# Altium schematic sheet Power Supply.SchDoc: Power Supply
size A4; Engineer: M.GUENI; Organization: Altium Limited; Address1: L3, 12a Rodborough Rd; Address2: Frenchs Forest; Address3: NSW; Address4: Australia 2086; Revision: R0; SheetNumber: 2; SheetTotal: 8
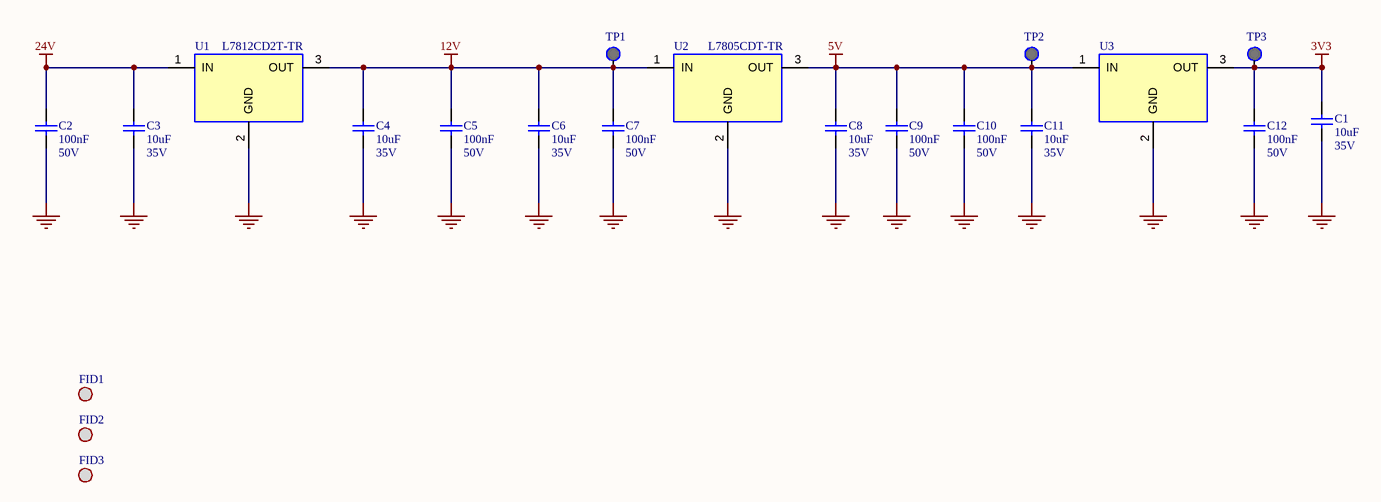
[diagram p0: Power Supply.SchDoc]

## Parts
C1  Value 1: 10uF  Value 2: 35V  [CAPC1608N]  (hidden comment: Capacitor)
C2  Value 1: 100nF  Value 2: 50V  [CAPC1608N]  (hidden comment: Capacitor)
C3  Value 1: 10uF  Value 2: 35V  [CAPC1608N]  (hidden comment: Capacitor)
C4  Value 1: 10uF  Value 2: 35V  [CAPC1608N]  (hidden comment: Capacitor)
C5  Value 1: 100nF  Value 2: 50V  [CAPC1608N]  (hidden comment: Capacitor)
C6  Value 1: 10uF  Value 2: 35V  [CAPC1608N]  (hidden comment: Capacitor)
C7  Value 1: 100nF  Value 2: 50V  [CAPC1608N]  (hidden comment: Capacitor)
C8  Value 1: 10uF  Value 2: 35V  [CAPC1608N]  (hidden comment: Capacitor)
C9  Value 1: 100nF  Value 2: 50V  [CAPC1608N]  (hidden comment: Capacitor)
C10  Value 1: 100nF  Value 2: 50V  [CAPC1608N]  (hidden comment: Capacitor)
C11  Value 1: 10uF  Value 2: 35V  [CAPC1608N]  (hidden comment: Capacitor)
C12  Value 1: 100nF  Value 2: 50V  [CAPC1608N]  (hidden comment: Capacitor)
FID1  Fiducial  [FIDUCIAL-1MM]  (value not drawn)
FID2  Fiducial  [FIDUCIAL-1MM]  (value not drawn)
FID3  Fiducial  [FIDUCIAL-1MM]  (value not drawn)
TP1  Test Point  [TP]  (value not drawn)  (no BOM)
TP2  Test Point  [TP]  (value not drawn)  (no BOM)
TP3  Test Point  [TP]  (value not drawn)  (no BOM)
U1  L7812CD2T-TR  [D2PAK]
U2  L7805CDT-TR  [D2PAK]
U3  (no value)  [DPAK]

## Nets
3V3: C1.2 C12.1 TP3.1 U3.3(OUT)
5V: C8.2 C9.1 C10.1 C11.2 TP2.1 U2.3(OUT) U3.1(IN)
12V: C4.2 C5.1 C6.2 C7.1 TP1.1 U1.3(OUT) U2.1(IN)
24V: C2.1 C3.2 U1.1(IN)
GND: C1.1 C2.2 C3.1 C4.1 C5.2 C6.1 C7.2 C8.1 C9.2 C10.2 C11.1 C12.2 U1.2(GND) U2.2(GND) U3.2(GND)

## Notes on the sheet
- THIS DOCUMENT AND THE DATA DISCLOSED HEREIN OR
- HEREWITH IS THE PROPERTY OF ALTIUM LIMITED AND MAY
- DWG NO:
- REVISION
- REV:
- DESCRIPTION
- DATE
- APPROVED
- BE FREELY DISTRIBUTED IN WHOLE. NO RIGHTS ARE
- RESERVED OR EXPRESS OR IMPLIED WARANTEE GIVEN.
- ENG:
- APPROVALS
- PROJECT
- DSN:
- CHK:
- REFERENCE DOCUMENTS
- PROJECT REVISION:
- TITLE
- DOCUMENT REVISION:
- DESIGN ITEM:
- BOM:
- FAB DWG:
- PCB DWG:
- ASSY DWG:
- SCALE:
- A3
- SIZE
- CAGE CODE
- FILE NAME
- DWG NO.
- SHEET
- OF
- REV

## Library data of the parts
C1 C3 C4 C6 C8 C11 = CAP-000000006: MAN: Murata Electronics; MANREF: GRM188R6YA106MA73D; DES: Multilayer Ceramic Capacitors MLCC - SMD/SMT 0603 10uF 35volts *Derate Voltage/Temp; TOL: 20%; FTP: 0603; SUP: Mouser; SUPREF: 81-GRM188R6YA106MA3D; NOTE: _; Part Number: CAP-000000006
C2 C5 C7 C9 C10 C12 = CAP-000000002: MAN: VISHAY; MANREF: VJ0603V104ZXAPW1BC; DES: VJ0603V104ZXAPW1BC -  Condensateur céramique multicouche CMS, 0.1 µF, 50 V, 0603 [1608 Metric], +80%, -20%, Y5V; TOL: +80% -20%; FTP: 0603; SUP: Farnell; SUPREF: 2896408; NOTE: _; Part Number: CAP-000000002
FID1-FID3 = MIS-000000004: MAN: _; Value 1: 1mm; Part Number: MIS-000000004; MANREF: _; DES: _; Value 2: _; TOL: _; FTP: _; SUP: _; SUPREF: _; NOTE: _
TP1-TP3 = MIS-000000003: MAN: _; Part Number: MIS-000000003; MANREF: _; DES: _; Value 1: _; Value 2: _; TOL: _; FTP: _; SUP: _; SUPREF: _; NOTE: _
U1 = VRG-000000002: MAN: STMicroelectronics; DES: Linear Voltage Regulators 12V 1.5A Positive; Value 1: 12V; Value 2: 1.5A; TOL: _; SUP: Mouser; SUPREF: 511-L7812CD2T-TR; Part Number: VRG-000000002; MANREF: L7812CD2T-TR; FTP: D2PAK; NOTE: _
U2 = VRG-000000001: MAN: STMicroelectronics; DES: Linear Voltage Regulators 5.0V 1.5A Positive; Value 1: 5V; Value 2: 1.5A; TOL: _; SUP: Mouser; SUPREF: 511-L7805CDT-TR; Part Number: VRG-000000001; MANREF: L7805CDT-TR; FTP: D2PAK; NOTE: _
U3 = VRG-000000003: MAN: STMicroelectronics; MANREF: LF33CDT-TRY; DES: Linear Voltage Regulators VLDV Reg Inhibit 0.45V 50uA 500mA; Value 1: 3V3; Value 2: 1A; TOL: _; SUP: Mouser; SUPREF: 511-LF33CDT-TRY; Part Number: VRG-000000003; FTP: DPAK; NOTE: _